# EAGLE design matrix (EAGLE 8.6.2)
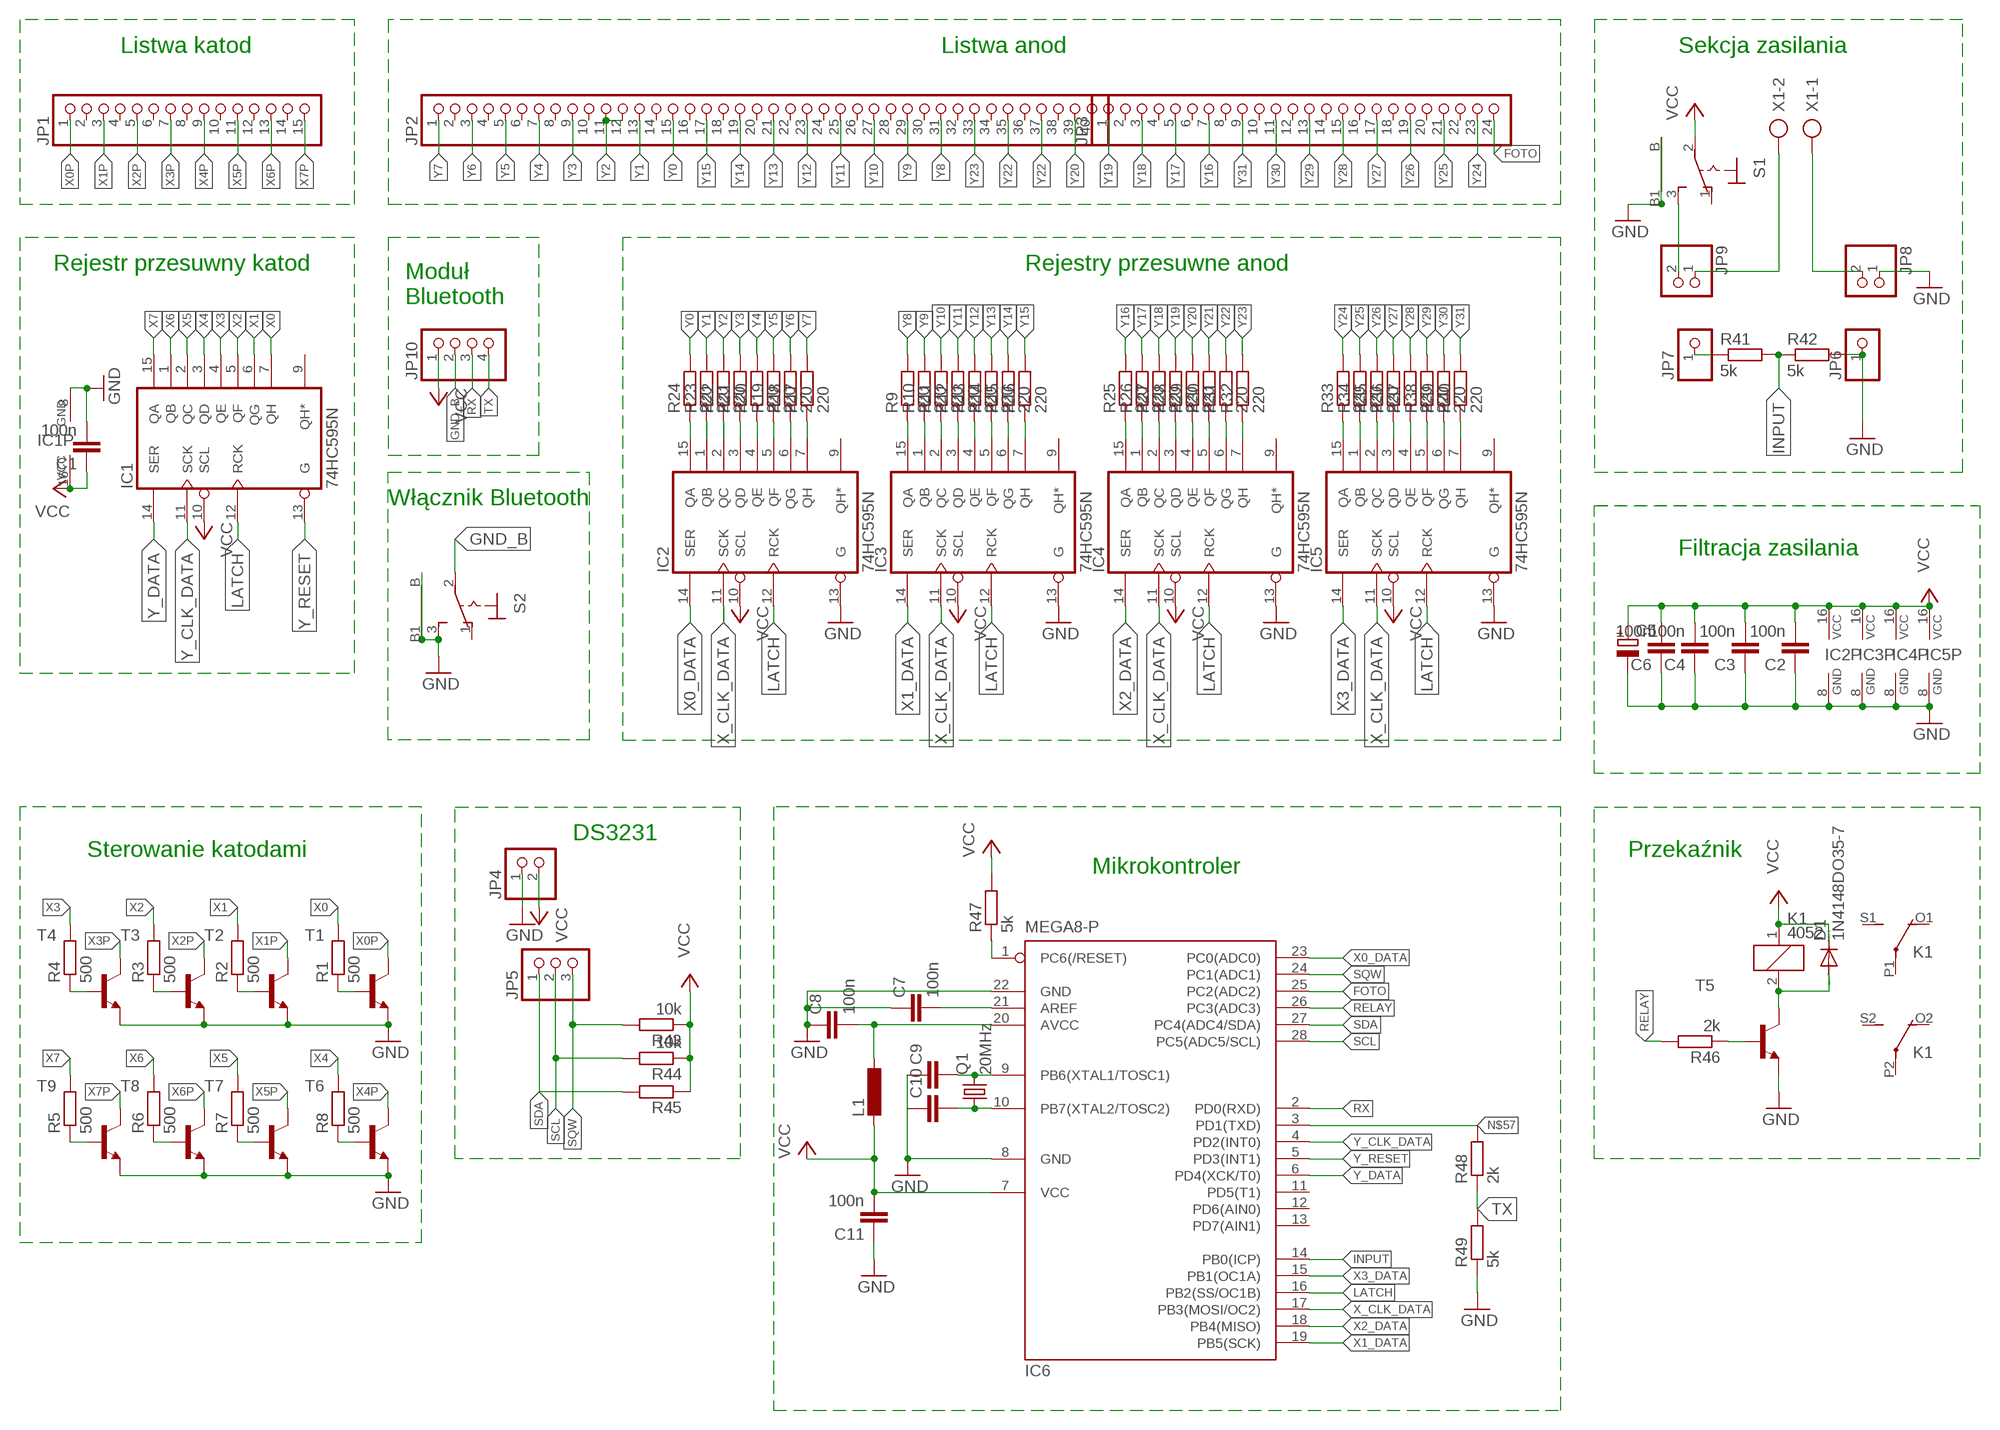
[diagram p0: schematic, sheet 1]

## Parts
C1  100n  C-EU025-025X050  [C025-025X050]
C2  100n  C-EU025-025X050  [C025-025X050]
C3  100n  C-EU025-025X050  [C025-025X050]
C4  100n  C-EU025-025X050  [C025-025X050]
C5  CPOL-EUE2.5-7  [E2,5-7]
C6  100n  C-EU025-025X050  [C025-025X050]
C7  100n  C-EU025-025X050  [C025-025X050]
C8  100n  C-EU025-025X050  [C025-025X050]
C9  C-EU025-025X050  [C025-025X050]
C10  C-EU025-025X050  [C025-025X050]
C11  100n  C-EU025-025X050  [C025-025X050]
D1  1N4148DO35-7  [DO35-7]
IC1  74HC595N  [DIL16]
IC2  74HC595N  [DIL16]
IC3  74HC595N  [DIL16]
IC4  74HC595N  [DIL16]
IC5  74HC595N  [DIL16]
IC6  MEGA8-P  [DIL28-3]
JP1  PINHD-1X15  [1X15]
JP2  PINHD-1X40  [1X40]
JP3  PINHD-1X24  [1X24]
JP4  PINHD-1X2  [1X02]
JP5  PINHD-1X3  [1X03]
JP6  PINHD-1X1  [1X01]
JP7  PINHD-1X1  [1X01]
JP8  PINHD-1X2  [1X02]
JP9  PINHD-1X2  [1X02]
JP10  PINHD-1X4  [1X04]
K1  4052  [F4052]
L1  L-EU0207/10  [0207/10]
Q1  20MHz  CRYSTALHC49S  [HC49/S]
R1  500  R-EU_0204/5  [0204/5]
R2  500  R-EU_0204/5  [0204/5]
R3  500  R-EU_0204/5  [0204/5]
R4  500  R-EU_0204/5  [0204/5]
R5  500  R-EU_0204/5  [0204/5]
R6  500  R-EU_0204/5  [0204/5]
R7  500  R-EU_0204/5  [0204/5]
R8  500  R-EU_0204/5  [0204/5]
R9  220  R-EU_0204/5  [0204/5]
R10  220  R-EU_0204/5  [0204/5]
R11  220  R-EU_0204/5  [0204/5]
R12  220  R-EU_0204/5  [0204/5]
R13  220  R-EU_0204/5  [0204/5]
R14  220  R-EU_0204/5  [0204/5]
R15  220  R-EU_0204/5  [0204/5]
R16  220  R-EU_0204/5  [0204/5]
R17  220  R-EU_0204/5  [0204/5]
R18  220  R-EU_0204/2V  [0204V]
R19  220  R-EU_0204/2V  [0204V]
R20  220  R-EU_0204/5  [0204/5]
R21  R-EU_0204/5  [0204/5]
R22  220  R-EU_0204/5  [0204/5]
R23  220  R-EU_0204/5  [0204/5]
R24  220  R-EU_0204/5  [0204/5]
R25  220  R-EU_0204/5  [0204/5]
R26  220  R-EU_0204/5  [0204/5]
R27  220  R-EU_0204/5  [0204/5]
R28  220  R-EU_0204/5  [0204/5]
R29  220  R-EU_0204/5  [0204/5]
R30  R-EU_0204/5  [0204/5]
R31  220  R-EU_0204/5  [0204/5]
R32  220  R-EU_0204/5  [0204/5]
R33  220  R-EU_0204/5  [0204/5]
R34  220  R-EU_0204/5  [0204/5]
R35  220  R-EU_0204/5  [0204/5]
R36  R-EU_0204/5  [0204/5]
R37  220  R-EU_0204/5  [0204/5]
R38  220  R-EU_0204/5  [0204/5]
R39  220  R-EU_0204/5  [0204/5]
R40  220  R-EU_0204/5  [0204/5]
R41  5k  R-EU_0204/5  [0204/5]
R42  5k  R-EU_0204/5  [0204/5]
R43  10k  R-EU_0207/7  [0207/7]
R44  10k  R-EU_0204/5  [0204/5]
R45  R-EU_0204/5  [0204/5]
R46  2k  R-EU_0207/7  [0207/7]
R47  5k  R-EU_0204/2V  [0204V]
R48  2k  R-EU_0204/5  [0204/5]
R49  5k  R-EU_0204/5  [0204/5]
S1  9070-1W  [9070-1W]
S2  9070-1W  [9070-1W]
T1  BC337-16-NPN-TO92-CBE  [TO92-CBE]
T2  BC337-16-NPN-TO92-CBE  [TO92-CBE]
T3  BC337-16-NPN-TO92-CBE  [TO92-CBE]
T4  BC337-16-NPN-TO92-CBE  [TO92-CBE]
T5  BC337-16-NPN-TO92-CBE  [TO92-CBE]
T6  BC337-16-NPN-TO92-CBE  [TO92-CBE]
T7  BC337-16-NPN-TO92-CBE  [TO92-CBE]
T8  BC337-16-NPN-TO92-CBE  [TO92-CBE]
T9  BC337-16-NPN-TO92-CBE  [TO92-CBE]
X1  AK300/2  [AK300/2]

## Nets
FOTO: IC6.25(PC2(ADC2)) JP3.24
GND: C1.2 C2.1 C3.1 C4.1 C5.- C6.1 C7.1 C8.1 C9.1 C10.1 C11.1 IC1.8(GND) IC2.8(GND) IC2.13(G) IC3.8(GND) IC3.13(G) IC4.8(GND) IC4.13(G) IC5.8(GND) IC5.13(G) IC6.8(GND) IC6.22(GND) JP4.1 JP6.1 JP8.1 R42.2 R49.1 S1.B S1.B1 S2.3(S) S2.B S2.B1 T1.E T2.E T3.E T4.E T5.E T6.E T7.E T8.E T9.E
GND_B: JP10.2 S2.2(P)
INPUT: IC6.14(PB0(ICP)) R41.2 R42.1
LATCH: IC1.12(RCK) IC2.12(RCK) IC3.12(RCK) IC4.12(RCK) IC5.12(RCK) IC6.16(PB2(SS/OC1B))
N$1: R4.1 T4.B
N$2: JP9.1 X1.2
N$3: IC2.15(QA) R24.1
N$4: R3.1 T3.B
N$5: R2.1 T2.B
N$6: R1.1 T1.B
N$7: R8.1 T6.B
N$8: R7.1 T7.B
N$9: R6.1 T8.B
N$10: R5.1 T9.B
N$11: JP8.2 X1.1
N$12: IC2.1(QB) R23.1
N$13: IC2.2(QC) R22.1
N$14: JP7.1 R41.1
N$15: IC2.3(QD) R21.1
N$16: IC2.4(QE) R20.1
N$17: IC2.5(QF) R19.1
N$18: IC2.6(QG) R18.1
N$19: IC2.7(QH) R17.1
N$20: IC3.15(QA) R9.1
N$21: IC3.1(QB) R10.1
N$22: IC3.2(QC) R11.1
N$23: IC3.3(QD) R12.1
N$24: IC3.4(QE) R13.1
N$25: IC3.5(QF) R14.1
N$26: IC3.6(QG) R15.1
N$27: IC3.7(QH) R16.1
N$28: IC4.7(QH) R32.1
N$29: IC4.6(QG) R31.1
N$30: IC4.5(QF) R30.1
N$31: IC4.4(QE) R29.1
N$32: IC4.3(QD) R28.1
N$33: IC4.2(QC) R27.1
N$34: IC4.1(QB) R26.1
N$35: IC4.15(QA) R25.1
N$36: JP9.2 S1.3(S)
N$41: C9.2 IC6.9(PB6(XTAL1/TOSC1)) Q1.2
N$42: C10.2 IC6.10(PB7(XTAL2/TOSC2)) Q1.1
N$43: C7.2 IC6.21(AREF)
N$44: IC5.15(QA) R33.1
N$45: IC5.1(QB) R34.1
N$46: IC5.2(QC) R35.1
N$47: IC5.3(QD) R36.1
N$48: IC5.4(QE) R37.1
N$49: IC5.5(QF) R38.1
N$50: IC5.6(QG) R39.1
N$51: IC5.7(QH) R40.1
N$52: C8.2 IC6.20(AVCC) L1.1
N$53: D1.A K1.2 T5.C
N$54: R46.1 T5.B
N$56: IC6.1(PC6(/RESET)) R47.1
N$57: IC6.3(PD1(TXD)) R48.2
RELAY: IC6.26(PC3(ADC3)) R46.2
RX: IC6.2(PD0(RXD)) JP10.3
SCL: IC6.28(PC5(ADC5/SCL)) JP5.2 R44.2
SDA: IC6.27(PC4(ADC4/SDA)) JP5.1 R45.2
SQW: IC6.24(PC1(ADC1)) JP5.3 R43.2
TX: JP10.4 R48.1 R49.2
VCC: C1.1 C2.2 C3.2 C4.2 C5.+ C6.2 C11.2 D1.C IC1.10(SCL) IC1.16(VCC) IC2.10(SCL) IC2.16(VCC) IC3.10(SCL) IC3.16(VCC) IC4.10(SCL) IC4.16(VCC) IC5.10(SCL) IC5.16(VCC) IC6.7(VCC) JP4.2 JP10.1 K1.1 L1.2 R43.1 R44.1 R45.1 R47.2 S1.2(P)
X0: IC1.7(QH) R1.2
X0_DATA: IC2.14(SER) IC6.23(PC0(ADC0))
X0P: JP1.1 T1.C
X1: IC1.6(QG) R2.2
X1_DATA: IC3.14(SER) IC6.19(PB5(SCK))
X1P: JP1.3 T2.C
X2: IC1.5(QF) R3.2
X2_DATA: IC4.14(SER) IC6.18(PB4(MISO))
X2P: JP1.5 T3.C
X3: IC1.4(QE) R4.2
X3_DATA: IC5.14(SER) IC6.15(PB1(OC1A))
X3P: JP1.7 T4.C
X4: IC1.3(QD) R8.2
X4P: JP1.9 T6.C
X5: IC1.2(QC) R7.2
X5P: JP1.11 T7.C
X6: IC1.1(QB) R6.2
X6P: JP1.13 T8.C
X7: IC1.15(QA) R5.2
X7P: JP1.15 T9.C
X_CLK_DATA: IC2.11(SCK) IC3.11(SCK) IC4.11(SCK) IC5.11(SCK) IC6.17(PB3(MOSI/OC2))
Y0: JP2.15 R24.2
Y1: JP2.13 R23.2
Y2: JP2.11 JP2.12 R22.2
Y3: JP2.9 R21.2
Y4: JP2.7 R20.2
Y5: JP2.5 R19.2
Y6: JP2.3 R18.2
Y7: JP2.1 R17.2
Y8: JP2.31 R9.2
Y9: JP2.29 R10.2
Y10: JP2.27 R11.2
Y11: JP2.25 R12.2
Y12: JP2.23 R13.2
Y13: JP2.21 R14.2
Y14: JP2.19 R15.2
Y15: JP2.17 R16.2
Y16: JP3.7 R25.2
Y17: JP3.5 R26.2
Y18: JP3.3 R27.2
Y19: JP3.1 R28.2
Y20: JP2.39 R29.2
Y21: JP2.37 R30.2
Y22: JP2.35 R31.2
Y23: JP2.33 R32.2
Y24: JP3.23 R33.2
Y25: JP3.21 R34.2
Y26: JP3.19 R35.2
Y27: JP3.17 R36.2
Y28: JP3.15 R37.2
Y29: JP3.13 R38.2
Y30: JP3.11 R39.2
Y31: JP3.9 R40.2
Y_CLK_DATA: IC1.11(SCK) IC6.4(PD2(INT0))
Y_DATA: IC1.14(SER) IC6.6(PD4(XCK/T0))
Y_RESET: IC1.13(G) IC6.5(PD3(INT1))
Unconnected: IC1.9(QH*) IC2.9(QH*) IC3.9(QH*) IC4.9(QH*) IC5.9(QH*) IC6.11(PD5(T1)) IC6.12(PD6(AIN0)) IC6.13(PD7(AIN1)) JP1.2 JP1.4 JP1.6 JP1.8 JP1.10 JP1.12 JP1.14 JP2.2 JP2.4 JP2.6 JP2.8 JP2.10 JP2.14 JP2.16 JP2.18 JP2.20 JP2.22 JP2.24 JP2.26 JP2.28 JP2.30 JP2.32 JP2.34 JP2.36 JP2.38 JP2.40 JP3.2 JP3.4 JP3.6 JP3.8 JP3.10 JP3.12 JP3.14 JP3.16 JP3.18 JP3.20 JP3.22 K1.O1(2:O) K1.O2(3:O) K1.P1(2:P) K1.P2(3:P) K1.S1(2:S) K1.S2(3:S) S1.1(O) S2.1(O)

## Notes on the sheet
- Listwa katod | Listwa anod | Sekcja zasilania
- Rejestr przesuwny katod | Rejestry przesuwne anod
- Moduł
  Bluetooth
- Włącznik Bluetooth
- Filtracja zasilania
- DS3231
- Sterowanie katodami | Przekaźnik
- Mikrokontroler

## Library data of the parts
C1-C4 C6-C11 = resistor:C-EU: CAPACITOR, European symbol
C5 = resistor:CPOL-EU: POLARIZED CAPACITOR, European symbol
D1 = diode:1N4148: DIODE high speed (Philips)
IC1-IC5 = 74xx-eu:74*595: 8-bit SHIFT REGISTER, output latch
IC6 = atmel:MEGA8-P: MICROCONTROLLER 8 Kbytes FLASH, 1 kbytes SRAM, 512 bytes EEPROM, USART, 4-channel 10 bit ADC, 2-channel 8 bit ADC Pin compatible with Atmega48, ATMega88, ATMega168 Source: avr.lbr; OC_FARNELL: unknown; OC_NEWARK: unknown
JP1 = pinhead:PINHD-1X15: PIN HEADER
JP2 = pinhead:PINHD-1X40: PIN HEADER
JP3 = pinhead:PINHD-1X24: PIN HEADER
JP4 JP8 JP9 = pinhead:PINHD-1X2: PIN HEADER
JP5 = pinhead:PINHD-1X3: PIN HEADER
JP6 JP7 = pinhead:PINHD-1X1: PIN HEADER
JP10 = pinhead:PINHD-1X4: PIN HEADER
K1 = relay:4052: RELAY 2 x switch, Finder; OC_FARNELL: unknown; OC_NEWARK: unknown
L1 = resistor:L-EU: INDUCTOR, European symbol
Q1 = crystal:CRYSTAL: CRYSTAL; OC_FARNELL: 1667008; OC_NEWARK: unknown
R1-R49 = resistor:R-EU_: RESISTOR, European symbol
S1 S2 = switch:9070-1W: TOGGLE SWITCH Marquardt
T1-T9 = transistor:*-NPN-: NPN Transistror BF959 corrected 2008.03.06
X1 = con-ptr500:AK300/2: CONNECTOR; OC_FARNELL: unknown; OC_NEWARK: unknown

## Board
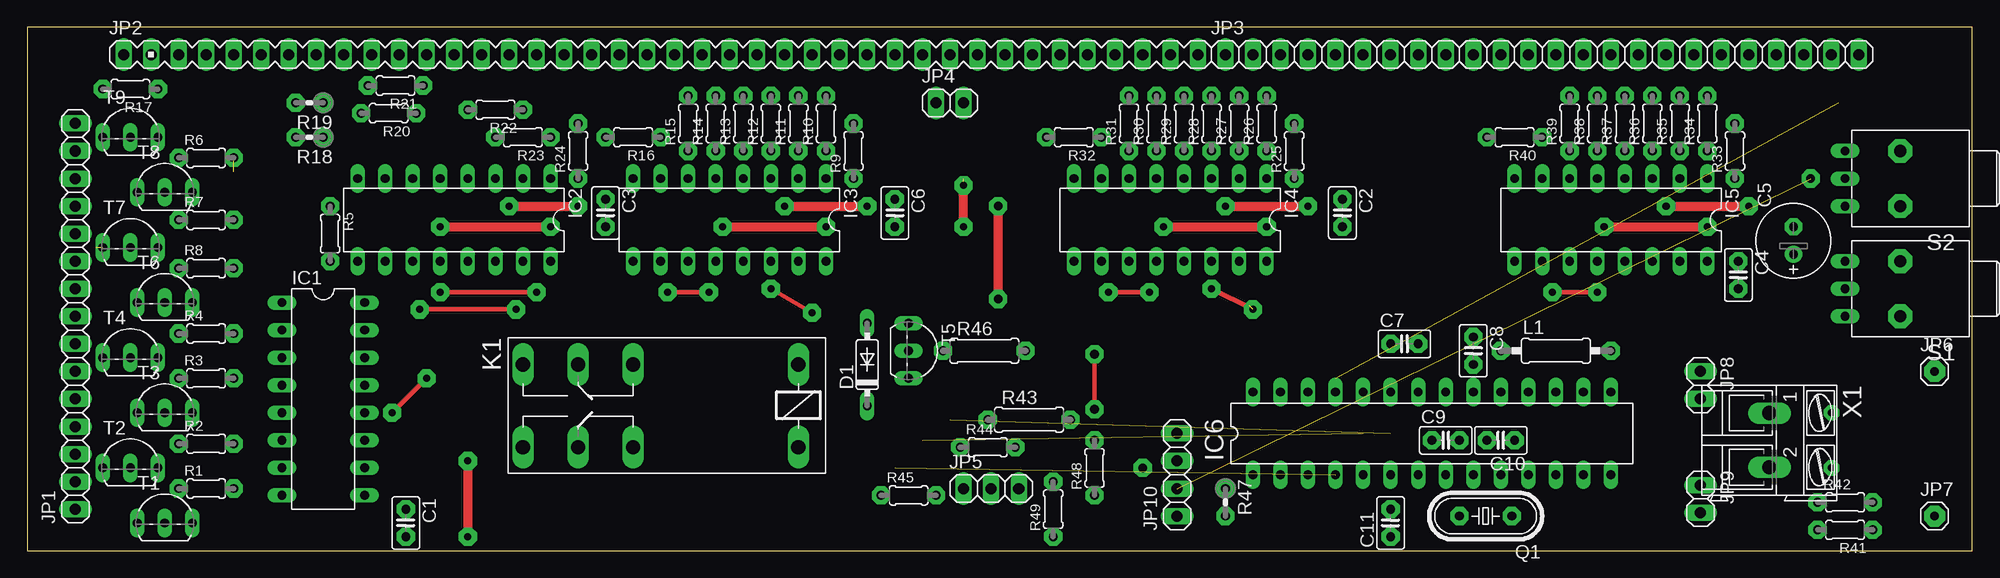
[diagram p1: board, top side]
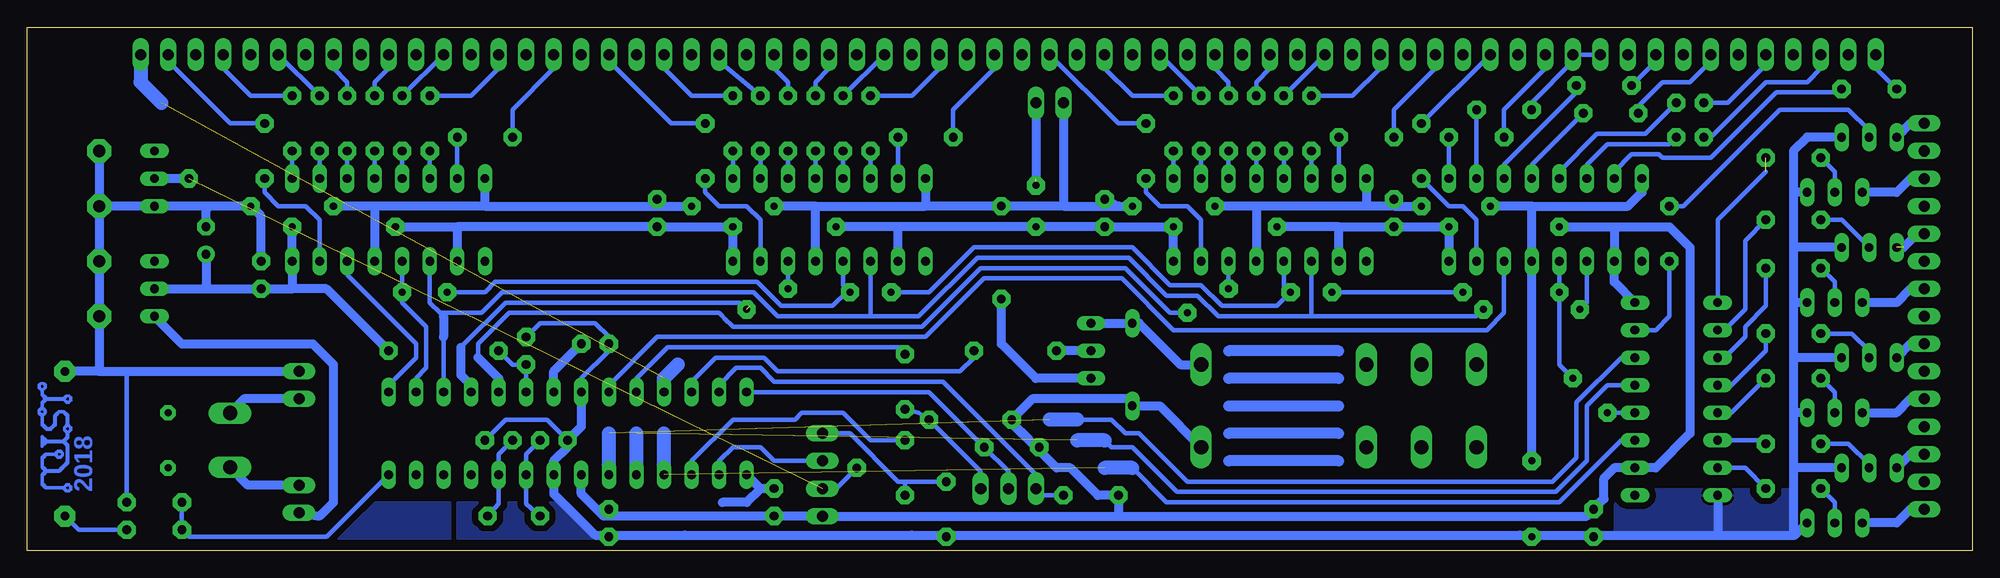
[diagram p2: board, bottom side, seen from below]

Size 179.38 x 48.25 mm. Coordinates in mm from the lower left corner, seen from the top.
Outline: 0,0 179.38,0 179.38,48.25 0,48.25 0,0
Copper layers (1*16): Top 0.035mm / dielectric 1.5mm / Bottom 0.035mm
Design rules "default *": minimum track width 6mil, minimum drill 0.35mm, track to track 6mil, track to pad 6mil, pad to pad 6mil, via to via 6mil, smd to smd 6mil, copper to edge 40mil, drill to drill 6mil, minimum pad ring 10mil, minimum via ring 8mil, stop-mask expansion 4mil, vias tented up to drill 0mil, thermal gap 10mil

### Footprints (pad centres in the part's own frame; a part is rotated, then mirrored left to right if it is on the bottom)
C025-025X050 = drill 0.813 pad 1.676 octagon: 1 -1.27,0; 2 1.27,0
E2,5-7 = drill 0.813 pad 1.6: + -1.27,0 | drill 0.813 pad 1.6 octagon: - 1.27,0
DO35-7 = drill 0.813 long: A 3.81,0; C -3.81,0
DIL16 = drill 0.813 long: 1 -8.89,-3.81; 2 -6.35,-3.81; 3 -3.81,-3.81; 4 -1.27,-3.81; 5 1.27,-3.81; 6 3.81,-3.81; 7 6.35,-3.81; 8 8.89,-3.81; 9 8.89,3.81; 10 6.35,3.81; 11 3.81,3.81; 12 1.27,3.81; 13 -1.27,3.81; 14 -3.81,3.81; 15 -6.35,3.81; 16 -8.89,3.81
DIL28-3 = drill 0.813 long: 1 -16.51,-3.81; 2 -13.97,-3.81; 3 -11.43,-3.81; 4 -8.89,-3.81; 5 -6.35,-3.81; 6 -3.81,-3.81; 7 -1.27,-3.81; 8 1.27,-3.81; 9 3.81,-3.81; 10 6.35,-3.81; 11 8.89,-3.81; 12 11.43,-3.81; 13 13.97,-3.81; 14 16.51,-3.81; 15 16.51,3.81; 16 13.97,3.81; 17 11.43,3.81; 18 8.89,3.81; 19 6.35,3.81; 20 3.81,3.81; 21 1.27,3.81; 22 -1.27,3.81; 23 -3.81,3.81; 24 -6.35,3.81; 25 -8.89,3.81; 26 -11.43,3.81; 27 -13.97,3.81; 28 -16.51,3.81
1X15 = drill 1.016 long: 1 -17.78,0; 2 -15.24,0; 3 -12.7,0; 4 -10.16,0; 5 -7.62,0; 6 -5.08,0; 7 -2.54,0; 8 0,0; 9 2.54,0; 10 5.08,0; 11 7.62,0; 12 10.16,0; 13 12.7,0; 14 15.24,0; 15 17.78,0
1X40 = drill 1.016 pad 1.422 long: 1 -49.53,0 | drill 1.016 long: 2 -46.99,0; 3 -44.45,0; 4 -41.91,0; 5 -39.37,0; 6 -36.83,0; 7 -34.29,0; 8 -31.75,0; 9 -29.21,0; 10 -26.67,0; 11 -24.13,0; 12 -21.59,0; 13 -19.05,0; 14 -16.51,0; 15 -13.97,0; 16 -11.43,0; 17 -8.89,0; 18 -6.35,0; 19 -3.81,0; 20 -1.27,0; 21 1.27,0; 22 3.81,0; 23 6.35,0; 24 8.89,0; 25 11.43,0; 26 13.97,0; 27 16.51,0; 28 19.05,0; 29 21.59,0; 30 24.13,0; 31 26.67,0; 32 29.21,0; 33 31.75,0; 34 34.29,0; 35 36.83,0; 36 39.37,0; 37 41.91,0; 38 44.45,0; 39 46.99,0; 40 49.53,0
1X24 = drill 1.016 long: 1 -29.21,0; 2 -26.67,0; 3 -24.13,0; 4 -21.59,0; 5 -19.05,0; 6 -16.51,0; 7 -13.97,0; 8 -11.43,0; 9 -8.89,0; 10 -6.35,0; 11 -3.81,0; 12 -1.27,0; 13 1.27,0; 14 3.81,0; 15 6.35,0; 16 8.89,0; 17 11.43,0; 18 13.97,0; 19 16.51,0; 20 19.05,0; 21 21.59,0; 22 24.13,0; 23 26.67,0; 24 29.21,0
1X02 = drill 1.016 long: 1 -1.27,0; 2 1.27,0
1X03 = drill 1.016 long: 1 -2.54,0; 2 0,0; 3 2.54,0
1X01 = drill 0.8 pad 1.93 octagon: 1 0,0
1X04 = drill 1.016 long: 1 -3.81,0; 2 -1.27,0; 3 1.27,0; 4 3.81,0
F4052 = drill 1.321 long: 1 -3.81,3.81; 2 -3.81,-3.81; O1 11.43,-3.81; O2 11.43,3.81; P1 16.51,-3.81; P2 16.51,3.81; S1 21.59,-3.81; S2 21.59,3.81
0207/10 = drill 0.813 pad 1.676 octagon: 1 -5.08,0; 2 5.08,0
HC49/S = drill 0.813 pad 1.676 octagon: 1 -2.413,0; 2 2.413,0
0204/5 = drill 0.813 pad 1.676 octagon: 1 -2.54,0; 2 2.54,0
0204V = drill 0.813 pad 1.676 octagon: 1 -1.27,0; 2 1.27,0
0207/7 = drill 0.813 pad 1.676 octagon: 1 -3.81,0; 2 3.81,0
9070-1W = drill 0.813 long: 1 5.08,-2.54; 2 5.08,0; 3 5.08,2.54 | drill 1.118 pad 2.184 octagon: B 0,-2.54; B1 0,2.54
TO92-CBE = drill 0.813 long: B 0,0; C -2.54,0; E 2.54,0
AK300/2 = drill 1.321 long: 1 -2.515,0; 2 2.489,0

### Placement (x,y rotation side)
C1  34.92,2.54 270 top
C2  121.28,31.11 270 top
C3  53.34,31.11 270 top
C4  157.8,25.4 270 top
C5  162.88,28.57 90 top
C6  80.01,31.11 270 top
C7  127,19.05 0 top
C8  133.35,18.41 270 top
C9  130.81,10.16 0 top
C10  135.89,10.16 180 top
C11  125.73,2.54 90 top
D1  77.47,17.14 90 top
IC1  27.3,13.97 270 top
IC2  39.37,30.48 180 top
IC3  64.77,30.48 180 top
IC4  105.41,30.48 180 top
IC5  146.05,30.48 180 top
IC6  129.54,10.79 0 top
JP1  4.45,21.59 90 top
JP2  58.42,45.72 0 top
JP3  139.7,45.72 0 top
JP4  85.09,41.27 0 top
JP5  88.9,5.71 0 top
JP6  175.9,16.51 0 top
JP7  175.9,3.17 0 top
JP8  154.31,15.24 270 top
JP9  154.31,4.76 270 top
JP10  106.05,6.99 90 top
K1  67.31,13.34 180 top
L1  140.97,18.41 0 top
Q1  134.49,3.17 180 top
R1  16.51,5.71 0 top
R2  16.51,9.84 0 top
R3  16.51,15.88 0 top
R4  16.51,20 0 top
R5  27.94,29.21 270 top
R6  16.51,36.2 0 top
R7  16.51,30.48 0 top
R8  16.51,26.04 0 top
R9  76.2,36.83 90 top
R10  73.66,39.37 90 top
R11  71.12,39.37 90 top
R12  68.58,39.37 90 top
R13  66.04,39.37 90 top
R14  63.5,39.37 90 top
R15  60.96,39.37 90 top
R16  55.88,38.1 180 top
R17  9.53,42.55 180 top
R18  26.04,38.1 180 top
R19  26.04,41.27 180 top
R20  33.34,40.32 180 top
R21  33.97,42.86 180 top
R22  43.18,40.64 180 top
R23  45.72,38.1 180 top
R24  50.8,36.83 90 top
R25  116.84,36.83 90 top
R26  114.3,39.37 90 top
R27  111.76,39.37 90 top
R28  109.22,39.37 90 top
R29  106.68,39.37 90 top
R30  104.14,39.37 90 top
R31  101.6,39.37 90 top
R32  96.52,38.1 180 top
R33  157.48,36.83 90 top
R34  154.94,39.37 90 top
R35  152.4,39.37 90 top
R36  149.86,39.37 90 top
R37  147.32,39.37 90 top
R38  144.78,39.37 90 top
R39  142.24,39.37 90 top
R40  137.16,38.1 180 top
R41  167.64,1.91 180 top
R42  167.64,4.45 0 top
R43  92.39,12.06 0 top
R44  88.58,9.53 0 top
R45  81.28,5.08 0 top
R46  88.27,18.41 0 top
R47  110.49,4.45 270 top
R48  98.42,7.62 90 top
R49  94.61,3.81 90 top
S1  172.72,24.13 180 top
S2  172.72,34.29 180 top
T1  12.7,2.54 0 top
T2  9.53,7.62 0 top
T3  12.7,12.7 0 top
T4  9.53,17.78 0 top
T5  81.28,18.41 270 top
T6  12.7,22.86 0 top
T7  9.53,27.94 0 top
T8  12.7,33.02 0 top
T9  9.53,38.1 0 top
U$1  [MIST]  175.26,5.4 90 bottom
X1  160.66,10.16 270 top

### Tracks (layer width: path | path; a pad name or v marks a point on that pad's centre or on a via)
FOTO  (1 unrouted)
  Bottom 1.27: JP3.24 168.91,43.18 167,41.27 | IC6.25 120.65,15.88 119.38,17.14
GND  (via drill 0.65 pad 1.68, 0.8 pad 1.68)
  Top 0.813: v110.49,31.75 v118.11,31.75 | v44.45,31.75 v50.8,31.75 | v69.85,31.75 v77.47,31.75 | v151.13,31.75 v158.75,31.75 | v40.64,8.26 v40.64,1.27 | v89.53,31.75 v89.53,23.18
  Bottom 0.406: 55.88,33.02 IC3.8 | C10.1 135.25,12.06 131.44,12.06 C9.1 | C11.1 118.75,1.42 | IC6.22 128.27,15.88 125.73,18.41 C7.1 125.73,19.68 127,20.95 132.08,20.95 C8.1 | R49.1 98.27,1.42 97.79,1.42 | R42.2 170.18,16.51
  Bottom 0.813: IC2.8 30.48,33.02 31.75,31.75 40.64,31.75 | 40.64,31.75 v44.45,31.75 | 53.34,31.75 55.88,31.75 | 53.34,31.75 v50.8,31.75 | 55.88,31.75 66.04,31.75 | 66.04,31.75 IC3.13 | 66.04,31.75 v69.85,31.75 | 40.64,31.75 IC2.13 v40.64,8.26 | IC3.8 55.88,31.75 | 83.82,31.75 78.74,31.75 | 83.82,31.75 v89.53,31.75 96.52,31.75 | 78.74,31.75 v77.47,31.75 | 106.68,31.75 96.52,31.75 | 106.68,31.75 v110.49,31.75 | IC4.8 96.52,31.75 | IC4.13 106.68,31.75 | 137.16,31.75 IC5.8 | 137.16,31.75 147.32,31.75 | 147.32,31.75 IC5.13 | 172.72,16.51 170.18,16.51 JP8.1 | 172.72,16.51 JP6.1 | 147.32,31.75 v151.13,31.75 | C6.1 78.74,31.75 | S2.B S2.B1 | JP4.1 83.82,31.75 | S2.B1 S2.3 162.56,31.75 | S2.B1 S1.B S1.B1 172.72,16.51 | 120.65,31.75 v118.11,31.75 | C2.1 120.65,31.75 | C3.1 53.34,31.75 | IC6.22 128.27,11.43 C9.1 129.54,9.53 130.81,8.26 IC6.8 130.81,5.23 127,1.42 118.75,1.42 97.79,1.42 41.76,1.42 | 41.76,1.42 v40.64,1.27 | T5.E 86.36,15.88 89.53,19.05 v89.53,23.18 | 41.76,1.42 34.92,1.42 | 34.92,1.42 23.5,1.42 | 23.5,1.42 16.36,1.42 | 16.36,1.42 T1.E | IC1.8 23.5,1.42 | C1.2 34.92,1.42 | 16.36,1.42 16.51,1.57 16.51,7.62 | 16.51,33.02 16.51,36.83 15.24,38.1 T9.E | 16.51,33.02 16.51,27.94 | 16.51,27.94 16.51,22.86 | 16.51,22.86 16.51,17.78 | 16.51,17.78 16.51,12.7 | 16.51,12.7 16.51,7.62 | T2.E 16.51,7.62 | T3.E 16.51,12.7 | T4.E 16.51,17.78 | T6.E 16.51,22.86 | T7.E 16.51,27.94 | T8.E 16.51,33.02 | C4.1 157.8,30.8 v158.75,31.75 162.56,31.75 | C5.- 162.88,31.43 162.56,31.75 | 137.16,31.75 120.65,31.75
  pour Bottom (isolate 0.61): 16.51,5.71 33.02,5.71 33.02,1.27 16.51,1.27
  pour Bottom (isolate 0.61): 129.54,4.45 139.7,4.45 139.7,0 125.09,0
GND_B  (via drill 0.8 pad 1.68)  (1 unrouted)
  Bottom 0.406: JP10.2 104.78,5.71 v102.87,7.62
  Bottom 0.813: v164.47,34.29 S2.2
INPUT
  Bottom 0.406: R42.1 R41.2 164.47,1.27 151.76,1.27 IC6.14
LATCH  (via drill 0.65 pad 1.68)
  Top 0.406: v99.69,23.81 v103.5,23.81 | v59.05,23.81 v62.87,23.81 | v140.65,23.81 v144.78,23.81 | v38.1,23.81 v46.99,23.81 | v33.66,12.7 v36.83,15.88
  Bottom 0.406: 38.1,26.04 IC2.12 v38.1,23.81 38.1,17.14 v36.83,15.88 | 104.14,23.5 v103.5,23.81 | v140.65,23.81 137.16,23.81 136.21,24.77 112.08,24.77 109.86,22.54 105.09,22.54 103.82,23.81 v103.5,23.81 | IC5.12 v144.78,23.81 | v59.05,23.81 v46.99,23.81 | IC1.12 v33.66,12.7 | IC3.12 63.5,23.81 v62.87,23.81 64.14,22.54 69.22,22.54 71.12,24.45 73.98,24.45 77.47,27.94 92.08,27.94 96.2,23.81 v99.69,23.81 | v144.78,23.81 144.46,23.81 | 143.51,15.24 IC6.16 143.51,15.88 142.56,16.83 142.56,20.64 144.78,22.86 v144.78,23.81 | IC4.12 104.14,24.45 v103.5,23.81
N$1
  Bottom 0.406: R4.1 11.11,20 9.53,18.41 T4.B
N$2
  Bottom 0.813: JP9.1 159.02,6.03 X1.2
N$3
  Bottom 0.406: R24.1 48.26,31.75 46.99,31.75 45.72,30.48 IC2.15
N$4
  Bottom 0.406: R3.1 12.7,14.61 T3.B
N$5
  Bottom 0.406: R2.1 11.43,9.84 9.53,7.94 T2.B
N$6
  Bottom 0.406: R1.1 12.7,4.45 T1.B
N$7
  Bottom 0.406: R8.1 12.7,24.77 T6.B
N$8
  Bottom 0.406: R7.1 12.06,30.48 T7.B
N$9
  Bottom 0.406: R6.1 12.7,34.92 T8.B
N$10
  Bottom 0.406: T9.B 9.53,38.73 11.43,40.64 17.78,40.64 26.67,31.75 R5.1
N$11
  Bottom 0.813: JP8.2 159.36,13.97 X1.1
N$12
  Bottom 0.406: R23.1 IC2.1
N$13
  Bottom 0.406: R22.1 IC2.2
N$14
  Bottom 0.406: 175.26,2.54 JP7.1 174.62,1.91 R41.1
N$15
  Bottom 0.406: IC2.3 43.18,35.56 36.51,42.23 R21.1
N$16
  Bottom 0.406: IC2.4 40.64,35.56 R20.1
N$17
  Bottom 0.406: R19.1 30.16,38.42 34.61,38.42 38.1,34.92 IC2.5
N$18
  Bottom 0.406: R18.1 27.94,37.47 33.66,37.47 35.56,35.56 IC2.6
N$19
  Bottom 0.406: R17.1 12.38,42.23 18.1,42.23 24.13,36.2 28.57,36.2 28.89,36.51 31.43,36.51 33.02,34.92 IC2.7
N$20
  Bottom 0.406: IC3.15 71.12,30.48 72.39,31.75 74.93,31.75 76.2,33.02 R9.1
N$21
  Bottom 0.406: R10.1 IC3.1
N$22
  Bottom 0.406: IC3.2 R11.1
N$23
  Bottom 0.406: R12.1 IC3.3
N$24
  Bottom 0.406: R13.1 IC3.4
N$25
  Bottom 0.406: R14.1 IC3.5
N$26
  Bottom 0.406: R15.1 IC3.6
N$27
  Bottom 0.406: R16.1 IC3.7
N$28
  Bottom 0.406: R32.1 IC4.7
N$29
  Bottom 0.406: IC4.6 R31.1
N$30
  Bottom 0.406: R30.1 IC4.5
N$31
  Bottom 0.406: R29.1 IC4.4
N$32
  Bottom 0.406: R28.1 IC4.3
N$33
  Bottom 0.406: R27.1 IC4.2
N$34
  Bottom 0.406: IC4.1 R26.1
N$35
  Bottom 0.406: IC4.15 111.76,30.48 113.03,31.75 115.57,31.75 116.84,33.02 R25.1
N$36
  Bottom 0.813: JP9.2 152.4,3.17 151.13,4.45 151.13,17.14 153.03,19.05 165.1,19.05 S1.3
N$37  (via drill 0.65 pad 1.68)
  other vias: 86.36,33.66
N$38
  pour Bottom (isolate 0.61): 140.34,4.45 147.96,4.45 152.4,0 140.34,0
N$39  (via drill 0.65 pad 1.42)
  other vias: 166.37,7.62
N$40  (via drill 0.65 pad 1.42)
  other vias: 166.37,12.7
N$41
  Bottom 0.406: Q1.2 133.35,4.32 IC6.9 133.35,8.89 C9.2
N$42
  Bottom 0.406: Q1.1 135.89,4.32 IC6.10 135.89,8.89 C10.2
N$43
  Bottom 0.813: IC6.21 130.81,16.51 C7.2
N$44
  Bottom 0.406: R33.1 157.48,33.02 156.21,31.75 153.67,31.75 152.4,30.48 IC5.15
N$45
  Bottom 0.406: IC5.1 R34.1
N$46
  Bottom 0.406: R35.1 IC5.2
N$47
  Bottom 0.406: R36.1 IC5.3
N$48
  Bottom 0.406: R37.1 IC5.4
N$49
  Bottom 0.406: R38.1 IC5.5
N$50
  Bottom 0.406: R39.1 IC5.6
N$51
  Bottom 0.406: R40.1 IC5.7
N$52
  Bottom 0.406: C8.2 IC6.20 | C8.2 133.99,17.14 | C8.2 134.62,17.14 L1.1
N$53
  Bottom 0.813: K1.2 73.03,17.14 76.83,20.95 D1.A T5.C
N$54
  Bottom 0.813: T5.B R46.1
N$55
  Bottom 1.016: 58.42,8.26 68.58,8.26
N$56
  Bottom 0.813: R47.1 111.76,5.71 | 111.76,5.71 IC6.1 | 111.76,5.71 113.03,4.45 115.25,4.45
N$57
  Bottom 0.406: IC6.3 118.11,8.26 114.3,12.06 108.58,12.06 107.95,12.7 104.14,12.7 101.6,10.16 R48.2
N$59
  Bottom 1.016: 58.42,10.79 68.58,10.79
N$60
  Bottom 1.016: 68.58,13.34 58.42,13.34
N$61
  Bottom 1.016: 58.42,15.88 68.58,15.88
N$62
  Bottom 1.016: 58.42,18.41 68.58,18.41
RELAY
  Bottom 0.406: 92.71,18.41 R46.2 92.08,17.78 93.34,16.51 110.17,16.51 111.44,17.78 115.89,17.78 118.11,15.56 IC6.26
RX
  Bottom 0.406: 115.57,7.62 IC6.2 115.57,8.26 114.3,9.53 111.76,9.53 110.49,8.26 JP10.3
SCL
  Bottom 0.406: 88.9,6.35 JP5.2 | 88.9,6.99 JP5.2 | JP5.2 88.9,7.3 R44.2 96.2,14.61 IC6.28
SDA
  Bottom 0.406: IC6.27 115.57,15.24 113.98,16.83 111.76,16.83 110.49,15.56 94.93,15.56 86.36,6.99 JP5.1 85.72,5.08 R45.2
SQW  (via drill 0.8 pad 1.68)
  Top 0.406: v98.42,13.02 v98.42,18.1
  Bottom 0.406: 91.44,6.99 JP5.3 91.44,7.3 R43.2 97.16,12.7 v98.42,13.02 | 123.19,15.24 IC6.24 123.19,15.88 120.33,18.73 98.74,18.73 v98.42,18.1
TX
  Bottom 0.406: JP10.4 103.5,10.79 99.06,6.35 98.42,6.35 | 98.42,5.71 R48.1 98.42,6.35 | R49.2 98.42,6.35
VCC  (via drill 0.65 pad 1.68)  (1 unrouted)
  Top 0.813: v145.41,29.84 v154.94,29.84 | v38.1,29.84 v48.26,29.84 | v64.14,29.84 v73.66,29.84 | v104.78,29.84 v114.3,29.84 | v86.36,29.84 86.36,33.97
  Bottom 0.406: 33.02,27.3 IC2.10 | 48.26,29.21 v48.26,29.84 | 58.42,27.94 IC3.10 | 73.66,29.21 IC3.16 | C11.2 125.73,3.17 | 86.95,10.2 86.36,9.53 R44.1 | R47.2 109.22,3.17
  Bottom 0.813: v38.1,29.84 33.02,29.84 | 33.02,29.84 33.02,27.3 | IC1.16 33.02,24.77 IC2.10 | IC2.16 v48.26,29.84 C3.2 58.42,29.84 | 58.42,29.84 v64.14,29.84 | IC3.10 58.42,29.84 | IC3.16 v73.66,29.84 C6.2 v86.36,29.84 99.06,29.84 | 33.02,29.84 27.94,29.84 26.04,27.94 26.04,10.79 29.21,7.62 IC1.10 33.02,7.62 33.97,6.67 33.97,4.76 C1.1 35.56,3.17 78.74,3.17 | 99.06,29.84 v104.78,29.84 | IC4.16 v114.3,29.84 C2.2 139.7,29.84 | IC4.10 99.06,29.84 | 139.7,29.84 IC5.10 | v145.41,29.84 139.7,29.84 | v154.94,29.84 IC5.16 154.94,24.13 | JP4.2 86.36,34.29 | S1.2 162.56,24.13 | 162.56,24.13 C4.2 154.94,24.13 | IC6.7 128.27,5.23 126.21,3.17 125.73,3.17 109.22,3.17 JP10.1 78.74,3.17 | 78.74,3.17 R45.1 80.64,5.08 83.19,7.62 84.45,7.62 86.36,9.53 88.58,11.75 R43.1 | L1.2 151.76,24.13 154.94,24.13 | 86.95,10.2 88.58,11.83 R43.1 | R43.1 86.68,13.97 77.47,13.97 D1.C 74.93,13.34 K1.1 | C5.+ 162.88,24.45 162.56,24.13
X0
  Bottom 0.406: 22.86,7.62 IC1.7 20.95,7.62 R1.2
X0_DATA
  Bottom 0.406: 43.18,25.4 IC2.14 43.18,21.91 44.77,20.32 73.66,20.32 78.42,25.08 91.12,25.08 96.52,19.68 121.28,19.68 125.73,15.24 IC6.23
X0P
  Bottom 0.813: 5.08,3.81 JP1.1 5.71,3.81 6.99,2.54 T1.C
X1
  Bottom 0.406: R2.2 18.41,10.16 IC1.6
X1_DATA  (via drill 0.65 pad 1.68)
  Top 0.406: v72.39,21.91 v68.58,24.13
  Bottom 0.406: IC3.14 v68.58,24.13 | v72.39,21.91 73.98,21.91 78.11,26.04 91.44,26.04 96.84,20.64 114.3,20.64 115.09,21.43 115.25,21.59 115.57,21.91 134.94,21.91 137.79,19.05 137.79,17.78
  Bottom 0.813: 137.79,17.78 135.89,15.88 IC6.19
X1P
  Bottom 0.813: 5.08,8.89 JP1.3 5.71,8.89 T2.C
X2
  Bottom 0.406: IC1.5 22.23,12.7 R3.2
X2_DATA  (via drill 0.65 pad 1.68)  (1 unrouted)
  Top 0.406: v109.22,24.13 v113.03,22.23
  Bottom 0.406: IC4.14 v109.22,24.13 | 112.71,22.54 112.39,22.23 | 139.38,18.73 135.25,22.86 113.67,22.86 v113.03,22.23 | 138.75,14.92 IC6.18
  Bottom 0.813: IC6.18 138.43,15.24 139.38,16.19 139.38,18.73
X2P
  Bottom 0.813: T3.C 6.99,12.7 5.71,13.97 JP1.5
X3
  Bottom 0.406: IC1.4 22.23,15.24 19.05,18.41 R4.2
X3_DATA
  Bottom 0.406: IC6.15 146.05,15.24 143.51,17.78 143.51,19.05 149.86,25.4 IC5.14
X3P
  Bottom 0.813: JP1.7 5.71,19.05 T4.C
X4
  Bottom 0.406: R8.2 19.05,22.54 20.95,20.64 20.95,19.68 22.86,17.78 IC1.3
X4P
  Bottom 0.813: 5.08,24.13 JP1.9 5.71,24.13 6.99,22.86 T6.C
X5
  Bottom 0.406: IC1.2 22.86,20.32 20.95,22.23 20.95,28.57 R7.2
X5P  (1 unrouted)
  Bottom 0.813: JP1.11 5.08,29.21 6.35,27.94
X6  (1 unrouted)
  Bottom 0.406: IC1.1 23.5,30.48 19.05,34.92
X6P
  Bottom 0.813: JP1.13 5.71,34.29 6.99,33.02 T8.C
X7
  Bottom 0.406: IC1.15 29.21,20.32 27.94,21.59 R5.2
X7P
  Bottom 0.813: JP1.15 5.71,39.37 T9.C
X_CLK_DATA  (via drill 0.65 pad 1.68)
  Top 0.406: v36.2,22.23 v45.09,22.23
  Bottom 0.406: v36.2,22.23 35.56,22.86 IC2.11 | 101.6,21.59 110.17,21.59 112.39,23.81 135.57,23.81 137.48,21.91 140.97,21.91 | 101.6,21.59 97.16,21.59 91.76,26.99 77.79,26.99 74.3,23.5 71.44,23.5 69.53,21.59 60.96,21.59 | 140.97,15.24 IC6.17 140.97,19.68 | IC5.11 142.24,22.86 141.29,21.91 140.97,21.91 | 60.96,21.59 45.72,21.59 v45.09,22.23 | IC3.11 60.96,21.59 | 140.97,21.91 140.97,21.59 | IC4.11 101.6,21.59
  Bottom 0.813: 140.97,21.59 140.97,19.68
Y0
  Bottom 0.406: R24.2 JP2.15
Y1
  Bottom 0.406: R23.2 43.18,38.73 43.18,39.37 43.18,40.64 39.37,44.45 JP2.13
Y2
  Bottom 0.406: 34.92,45.72 JP2.11 JP2.12 36.83,45.09 40.64,41.27 R22.2
Y3
  Bottom 0.406: R21.2 29.21,45.09 JP2.9
Y4
  Bottom 0.406: JP2.7 24.13,45.09 26.04,43.18 28.57,43.18 30.8,40.96 R20.2
Y5
  Bottom 0.406: R19.2 22.54,41.27 19.05,44.77 JP2.5
Y6
  Bottom 0.406: JP2.3 13.97,44.45 15.24,43.18 19.05,43.18 24.13,38.1 R18.2
Y7
  Bottom 0.406: JP2.1 8.89,44.45 R17.2
Y8
  Bottom 0.406: R9.2 78.74,39.37 JP2.31
Y9
  Bottom 0.406: R10.2 77.47,41.91 80.01,44.45 JP2.29
Y10
  Bottom 0.406: R11.2 JP2.27
Y11
  Bottom 0.406: R12.2 68.58,43.18 69.85,44.45 JP2.25
Y12
  Bottom 0.406: JP2.23 64.77,44.45 66.04,43.18 R13.2
Y13
  Bottom 0.406: JP2.21 R14.2
Y14
  Bottom 0.406: JP2.19 54.61,44.45 57.15,41.91 R15.2
Y15
  Bottom 0.406: JP2.17 49.53,44.45 52.07,41.91 53.34,40.64 R16.2
Y16
  Bottom 0.406: R25.2 120.02,39.37 125.73,45.09 JP3.7
Y17
  Bottom 0.406: 115.57,41.91 R26.2 118.11,41.91 120.65,44.45 JP3.5
Y18
  Bottom 0.406: R27.2 115.57,45.09 JP3.3
Y19
  Bottom 0.406: 110.49,45.09 JP3.1 110.49,44.45 109.22,43.18 R28.2
Y20
  Bottom 0.406: R29.2 106.68,43.18 105.41,44.45 JP2.39
Y21
  Bottom 0.406: JP2.37 R30.2
Y22
  Bottom 0.406: JP2.35 95.25,44.45 97.79,41.91 R31.2
Y23
  Bottom 0.406: JP2.33 90.17,44.45 93.98,40.64 R32.2
Y24
  Bottom 0.406: R33.2 160.66,39.37 166.37,45.09 JP3.23
Y25
  Bottom 0.406: R34.2 158.75,41.91 161.29,44.45 JP3.21
Y26
  Bottom 0.406: R35.2 JP3.19
Y27
  Bottom 0.406: R36.2 149.86,43.18 151.13,44.45 JP3.17
Y28
  Bottom 0.406: R37.2 147.32,43.18 146.05,44.45 JP3.15
Y29
  Bottom 0.406: R38.2 JP3.13
Y30
  Bottom 0.406: R39.2 138.43,41.91 135.89,44.45 JP3.11
Y31
  Bottom 0.406: R40.2 134.62,40.64 130.81,44.45 JP3.9
Y_CLK_DATA  (1 unrouted)
  Bottom 0.406: IC1.11 32.38,10.16 38.1,4.45 74.3,4.45 77.47,7.62
  Bottom 1.27: IC6.4 120.65,10.79 | 77.47,7.62 80.01,7.62
Y_DATA  (1 unrouted)
  Bottom 0.406: 31.75,17.78 IC1.14 32.38,17.78 36.51,13.65 36.51,8.57 38.73,6.35 72.39,6.35 76.83,10.79 78.11,10.79 79.38,12.06 83.19,12.06
  Bottom 1.27: IC6.6 125.73,10.79 | 82.55,12.06 83.19,12.06 85.09,12.06
Y_RESET  (1 unrouted)
  Bottom 0.406: 31.75,15.24 IC1.13 33.66,15.24 35.56,13.34 35.56,8.26 38.42,5.4 73.34,5.4 77.47,9.53 79.38,9.53 80.01,10.16
  Bottom 1.27: IC6.5 123.19,10.79 | 80.01,10.16 82.55,10.16

### Text on the board
Bottom: 2018